# Altium schematic sheet RS485 Communication Layer.SchDoc: RS485 Communication Layer
size 292 x 193 mm; SheetNumber: 2; SheetTotal: 5
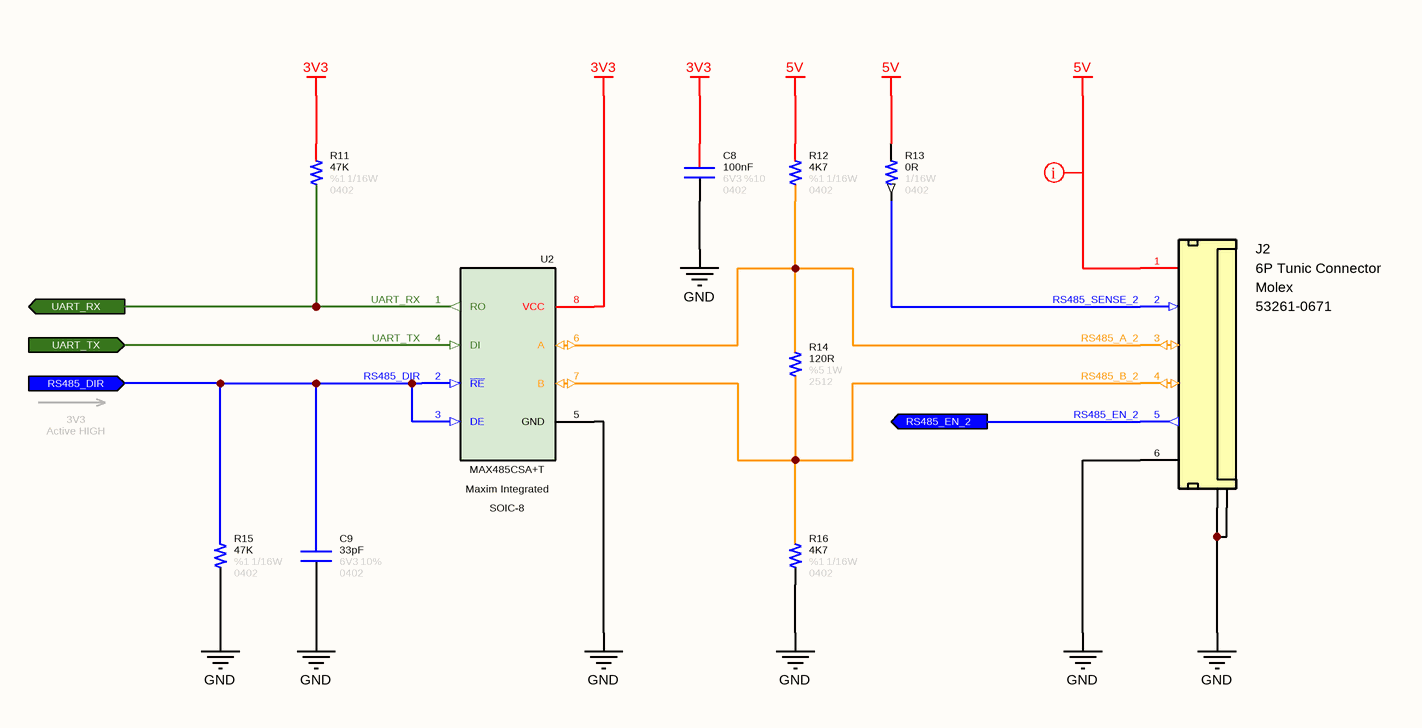
[diagram p0: RS485 Communication Layer.SchDoc]

## Parts
C8  value 100nF  Tolerance: %10  Voltage: 6V3  Case: 0402  [CAPACITOR_0402]  (hidden comment: Capacitor - 100nF [0402] (Ceramic))
C9  value 33pF  Tolerance: 10%  Case: 0402  Voltage: 6V3  [CAPACITOR_0402]  (hidden comment: Capacitor - 33pF [0402] (Ceramic))
J2  6P Tunic Connector  Manufacturer Part Number: 53261-0671  Manufacturer Name: Molex  [Connector_Tunic 6P]
R11  value 47K  Tolerance: %1  Case: 0402  Power: 1/16W  [RESISTOR_0402]  (hidden comment: 47K - 0402 - %1 - 1/16W)
R12  value 4K7  Tolerance: %1  Case: 0402  Power: 1/16W  [RESISTOR_0402]  (hidden comment: 4K7 - 0402 - %1 - 1/16W)
R13  value 0R  Case: 0402  Power: 1/16W  [RESISTOR_0402]  (hidden comment: 0R - 0402 - %1 - 1/16W)
R14  value 120R  Tolerance: %5  Case: 2512  Power: 1W  [RESISTOR_2512]  (hidden comment: 120R - 2512 - %5 - 1W)
R15  value 47K  Tolerance: %1  Case: 0402  Power: 1/16W  [RESISTOR_0402]  (hidden comment: 47K - 0402 - %1 - 1/16W)
R16  value 4K7  Tolerance: %1  Case: 0402  Power: 1/16W  [RESISTOR_0402]  (hidden comment: 4K7 - 0402 - %1 - 1/16W)
U2  Case: SOIC-8  Manufacturer Part Number: MAX485CSA+T  Manufacturer Name: Maxim Integrated  [SOP-8L (AZRS3080E)]  (hidden comment: RS485 Modulator)

## Ports
RS485_DIR (in), RS485_EN_2 (out), UART_RX (out), UART_TX (in)

## Nets
3V3: C8.2 R11.2 U2.8(VCC)
5V: J2.1(5V) R12.2 R13.2
GND: C8.1 C9.1 J2.6(GND) J2.7(GND) J2.8(GND) R15.1 R16.1 U2.5(GND)
RS485_A_2: J2.3(RS485-A) R12.1 R14.2 U2.6(A)
RS485_B_2: J2.4(RS485-B) R14.1 R16.2 U2.7(B)
RS485_DIR: C9.2 R15.2 U2.2(~{RE}) U2.3(DE) ; port RS485_DIR
RS485_EN_2: J2.5(INT) ; port RS485_EN_2
RS485_SENSE_2: J2.2(Sense) R13.1
UART_RX: R11.1 U2.1(RO) ; port UART_RX
UART_TX: U2.4(DI) ; port UART_TX

## Layout directives
rule Supply Nets [Voltage = 5.000]: 5V

## Notes on the sheet
- 3V3
  Active HIGH
- © 2021 All rights reserved.
  This document may not, in whole or in part, be copied, photocopied, reproduced, translated or converted to any electronic or machine readable from without prior written permission of Mehmet Günce Akkoyun.
  Engineer contact : akkoyun@me.com
- Property of
- Engineer :
- Date :
- Size :
- A4
- Time :
- Project :
- Page :
- /
- Customer :
- Product ID :
- Module ID :
- Version :
- File :
- Revision :

## Library data of the parts
C8 = Capacitor - 100nF [0402-6V3]: Capacitor - 100nF [0402-6V3] (Ceramic); Manufacturer Name: AVX; Manufacturer Part Number: 04026D104KAT4A; ComponentLink1Description: Mouser; ComponentLink1URL: https://www.mouser.com.tr/ProductDetail/AVX/04026D104KAT4A?qs=sGAEpiMZZMs0AnBnWHyRQPg4iYkCw7IMED%2F4kpqgf7w%3D; ComponentLink2Description: DataSheet; ComponentLink2URL: https://www.mouser.com.tr/datasheet/2/40/cx5r-776519.pdf
C9 = Capacitor - 33pF [0402-6V3]: Manufacturer Name: Kemet; Manufacturer Part Number: C0402C330J9RACAUTO; ComponentLink1Description: DataSheet; ComponentLink1URL: https://api.kemet.com/component-edge/download/datasheet/C0402C330J9RACAUTO.pdf; ComponentLink2Description: Mouser; ComponentLink2URL: https://www.mouser.com/Search/Refine.aspx?Keyword=80-C0402C330J9RAUTO
J2 = Connector - Mini Tunic 6P (1.25): Mini Tunic Connector with 6P; ROHS: Yes; System: Connector
R11 R15 = Resistor - 47K [0402]: Thick Film Resistors - SMD 1/16 W 47 KOhm 1%; Manufacturer Name: Vishay; Manufacturer Part Number: CRCW040247K0FKED; ComponentLink1Description: DataSheet; ComponentLink1URL: https://www.mouser.com.tr/datasheet/2/427/dcrcwe3-1762152.pdf; ComponentLink2Description: Mouser; ComponentLink2URL: https://www.mouser.com.tr/ProductDetail/Vishay-Dale/CRCW040247K0FKED?qs=sGAEpiMZZMu61qfTUdNhG2DpbjADlD3GL%252B3h1elTxqU%3D
R12 R16 = Resistor - 4K7 [0402]: Thick Film Resistors - SMD 1/16 W 4.7 KOhm 1%; Manufacturer Name: Vishay; Manufacturer Part Number: CRCW04024K70FKED; ComponentLink1Description: DataSheet; ComponentLink1URL: https://www.mouser.com.tr/datasheet/2/427/dcrcwe3-1762152.pdf; ComponentLink2Description: Mouser; ComponentLink2URL: https://www.mouser.com.tr/ProductDetail/Vishay-Dale/CRCW04024K70FKED?qs=sGAEpiMZZMu61qfTUdNhG7nHf%2F6MTUn3HadIdDQu24Q%3D
R13 = Resistor - 0R [0402]: Thick Film Resistors - SMD 1/16 W 0 Ohm; Manufacturer Name: Vishay; Manufacturer Part Number: CRCW04020000Z0ED; ComponentLink1Description: DataSheet; ComponentLink1URL: https://www.mouser.com.tr/datasheet/2/427/dcrcwe3-1762152.pdf; ComponentLink2Description: Mouser; ComponentLink2URL: https://www.mouser.com.tr/ProductDetail/Vishay-Dale/CRCW04020000Z0ED?qs=sGAEpiMZZMu61qfTUdNhG2DpbjADlD3GG34cJb50zyg%3D
R14 = Resistor - 120R [2512]: Thick Film Resistors - SMD 1 W 120 Ohm 5%; Manufacturer Name: YAGEO; Manufacturer Part Number: RC2512JK-07120RL; ComponentLink1Description: DataSheet; ComponentLink1URL: https://www.mouser.com.tr/datasheet/2/447/PYu_RC_Group_51_RoHS_L_11-1984063.pdf
U2 = IC - MAX485CSA+T: RS-422/RS-485 Interface IC Low-Power, Slew-Rate-Limited RS-485/RS-422 Transceivers; RoHS: Yes